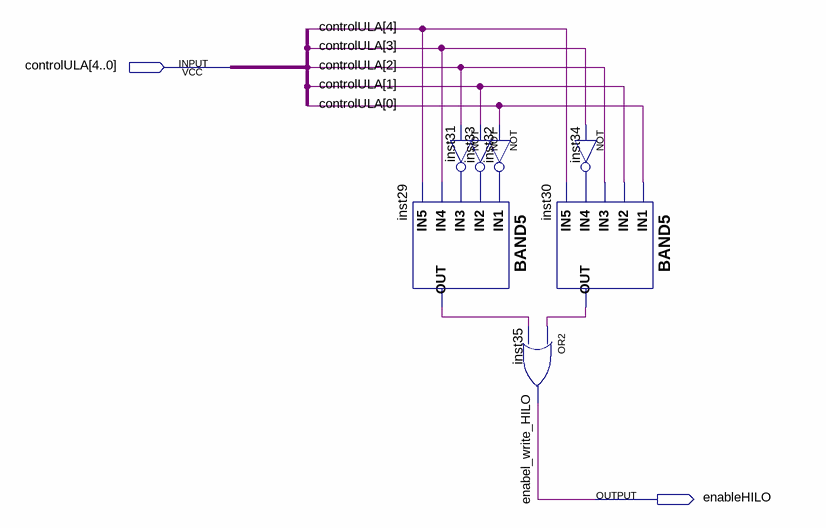
[diagram p0: schematic sheet]
// Quartus schematic controlHILO.bdf as structural Verilog: 7 symbols, 2 pins
module controlHILO (
  input  [4:0] controlULA,
  output enableHILO
);

  wire inst29_out, inst30_out, inst31_out, inst32_out, inst33_out, inst34_out;

  and inst29 (inst29_out, ~inst32_out, ~inst33_out, ~inst31_out, ~controlULA[3], ~controlULA[4]);  // BAND5
  not inst31 (inst31_out, controlULA[2]);
  not inst33 (inst33_out, controlULA[1]);
  not inst32 (inst32_out, controlULA[0]);
  and inst30 (inst30_out, ~controlULA[0], ~controlULA[1], ~controlULA[2], ~inst34_out, ~controlULA[4]);  // BAND5
  or inst35 (enableHILO, inst30_out, inst29_out);
  not inst34 (inst34_out, controlULA[3]);

  // Other names for the same wires on the sheet: enabel_write_HILO = enableHILO
endmodule
